# EAGLE design BOTTOM_BRD_v.0.1.0 (EAGLE 9.6.2)
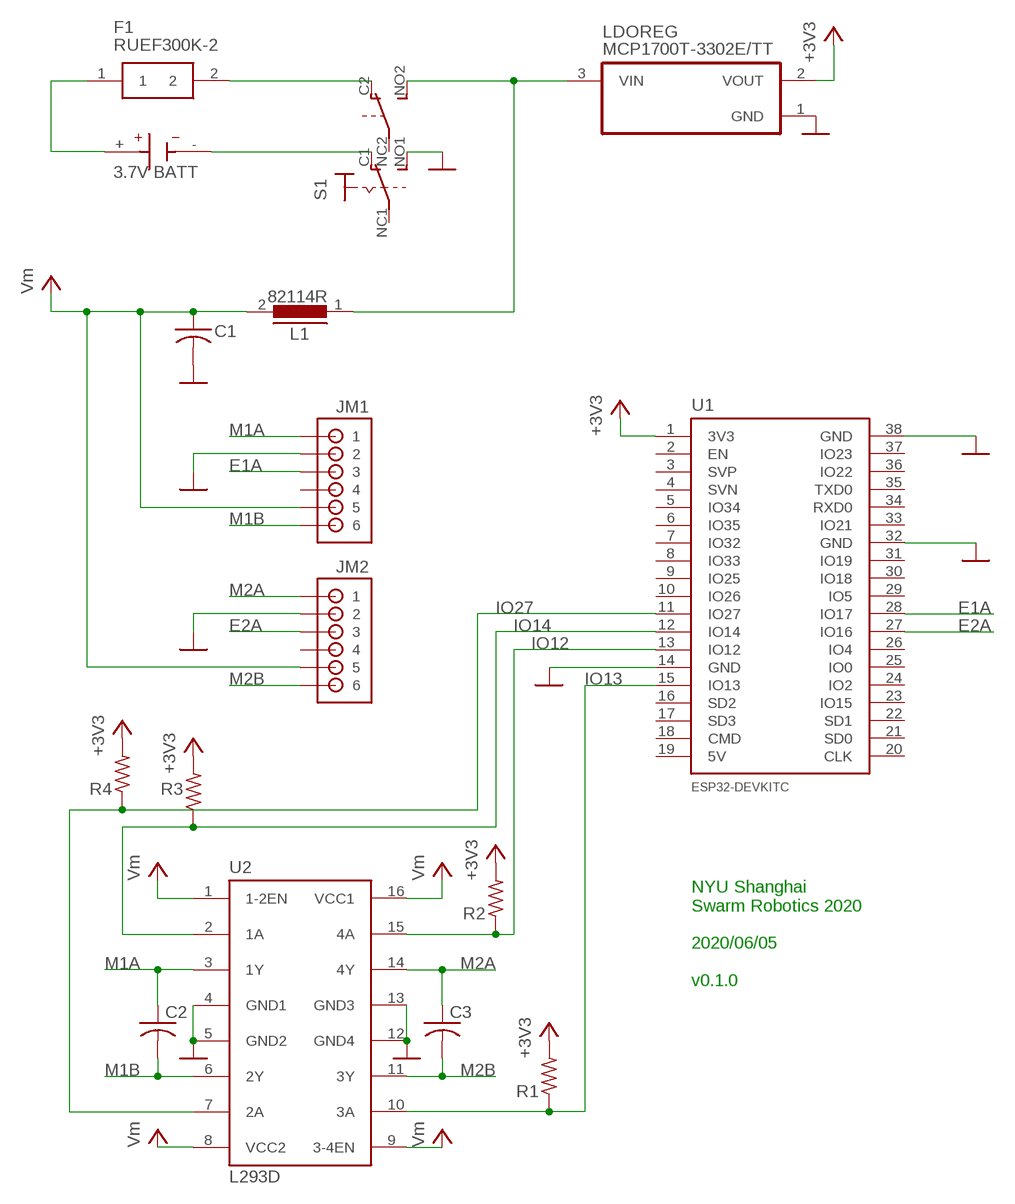
[diagram p0: schematic, sheet 1]

## Parts
BT1  3.7V BATT  6S-AA  [BAT_6S-AA]
C1  C-US025-030X050  [C025-030X050]
C2  C-US025-025X050  [C025-025X050]
C3  C-US025-025X050  [C025-025X050]
F1  RUEF300K-2  [RUEF300K2]
JM1  B6B-ZR  [B6B-ZR]
JM2  B6B-ZR  [B6B-ZR]
L1  82114R  [82114R]
LDOREG  MCP1700T-3302E/TT  [SOT95P237X112-3N]
R1  R-US_0207/9  [0207/9]
R2  R-US_0207/9  [0207/9]
R3  R-US_0207/9  [0207/9]
R4  R-US_0207/9  [0207/9]
S1  SWITCH_320-938  [PS22F03]
U1  ESP32DEVKITC  [ESP32-DEVKITC]
U2  L293D  [DIL16]

## Nets
+3V3: LDOREG.2(VOUT) R1.2 R2.2 R3.2 R4.2 U1.1(3V3)
E1A: JM1.3 U1.28(IO17)
E2A: JM2.3 U1.27(IO16)
GND: C1.2 JM1.2 JM2.2 LDOREG.1(GND) S1.NO1(1:S) U1.14(GND) U1.32(GND) U1.38(GND) U2.4(GND1) U2.5(GND2) U2.12(GND4) U2.13(GND3)
IO12: R2.1 U1.13(IO12) U2.15(4A)
IO13: R1.1 U1.15(IO13) U2.10(3A)
IO14: R3.1 U1.12(IO14) U2.2(1A)
IO27: R4.1 U1.11(IO27) U2.7(2A)
M1A: C2.1 JM1.1 U2.3(1Y)
M1B: C2.2 JM1.6 U2.6(2Y)
M2A: C3.1 JM2.1 U2.14(4Y)
M2B: C3.2 JM2.6 U2.11(3Y)
N$1: BT1.+ F1.1
N$3: F1.2 S1.C2(B:O)
N$5: BT1.- S1.C1(1:O)
N$6: L1.1 LDOREG.3(VIN) S1.NO2(B:S)
VCC: C1.1 JM1.5 JM2.5 L1.2 U2.1(1-2EN) U2.8(VCC2) U2.9(3-4EN) U2.16(VCC1) ; supply symbol labelled Vm
Unconnected: JM1.4 JM2.4 S1.NC1(1:P) S1.NC2(B:P) U1.2(EN) U1.3(SVP) U1.4(SVN) U1.5(IO34) U1.6(IO35) U1.7(IO32) U1.8(IO33) U1.9(IO25) U1.10(IO26) U1.16(SD2) U1.17(SD3) U1.18(CMD) U1.19(5V) U1.20(CLK) U1.21(SD0) U1.22(SD1) U1.23(IO15) U1.24(IO2) U1.25(IO0) U1.26(IO4) U1.29(IO5) U1.30(IO18) U1.31(IO19) U1.33(IO21) U1.34(RXD0) U1.35(TXD0) U1.36(IO22) U1.37(IO23)

## Notes on the sheet
- NYU Shanghai
  Swarm Robotics 2020
  
  2020/06/05
  
  v0.1.0

## Library data of the parts
BT1 = 6S-AA:6S-AA; AVAILABILITY: Unavailable; DESCRIPTION: BATTERY HOLDER AA PC PIN; DIGIKEY-PURCHASE-URL: https://snapeda.com/shop?store=DigiKey&id=4389101; MF: MPD; MP: 6S-AA; PACKAGE: None; PRICE: None
C1-C3 = adafruit:C-US: CAPACITOR, American symbol
F1 = RUEF300K-2:RUEF300K-2: TE CONNECTIVITY / RAYCHEM - RUEF300K-2 - RESETTABLE FUSE, PTC, 30V, 3A, RADIAL Source: Datasheet <http://www.farnell.com/datasheets/1482689.pdf>; DESCRIPTION: TE CONNECTIVITY / RAYCHEM - RUEF300K-2 - RESETTABLE FUSE, PTC, 30V, 3A, RADIAL; HEIGHT: 16.5mm; MANUFACTURER_NAME: TE CONNECTIVITY / RAYCHEM; MANUFACTURER_PART_NUMBER: RUEF300K-2
JM1 JM2 = B6B-ZR:B6B-ZR: JST-ZH Connector 6 pol, 1.5mm pitch Package: B6B-ZR Source: http://www.jst-mfg.com/product/pdf/eng/eZH.pdf; AVAILABILITY: Unavailable; DESCRIPTION: Connector Header Surface Mount 6 position 0.059 _1.50mm_; MF: JST; MP: B6B-ZR; PACKAGE: None; PRICE: None
L1 = inductors:82114R: INDUCTOR; SPICEPREFIX: L
LDOREG = MCP1700T-3302E_TT:MCP1700T-3302E/TT; AVAILABILITY: Unavailable; DESCRIPTION: IC REG LINEAR 3.3V 250MA SOT23-3; MF: Microchip Technology; MP: MCP1700T-3302E/TT; PACKAGE: None; PRICE: None
R1-R4 = adafruit:R-US_: RESISTOR, American symbol
S1 = ArduinoNano LearningBot 4-21-18:SWITCH_320-938: TOGGLE SWITCH distributor RS Components
U1 = ESP32-DEVKITC (1):ESP32DEVKITC
U2 = st-microelectronics:L293D: PUSH-PULL 4 CHANNEL DRIVER; MPN: L293D; OC_FARNELL: 9589619; OC_NEWARK: 56P8249

## Board
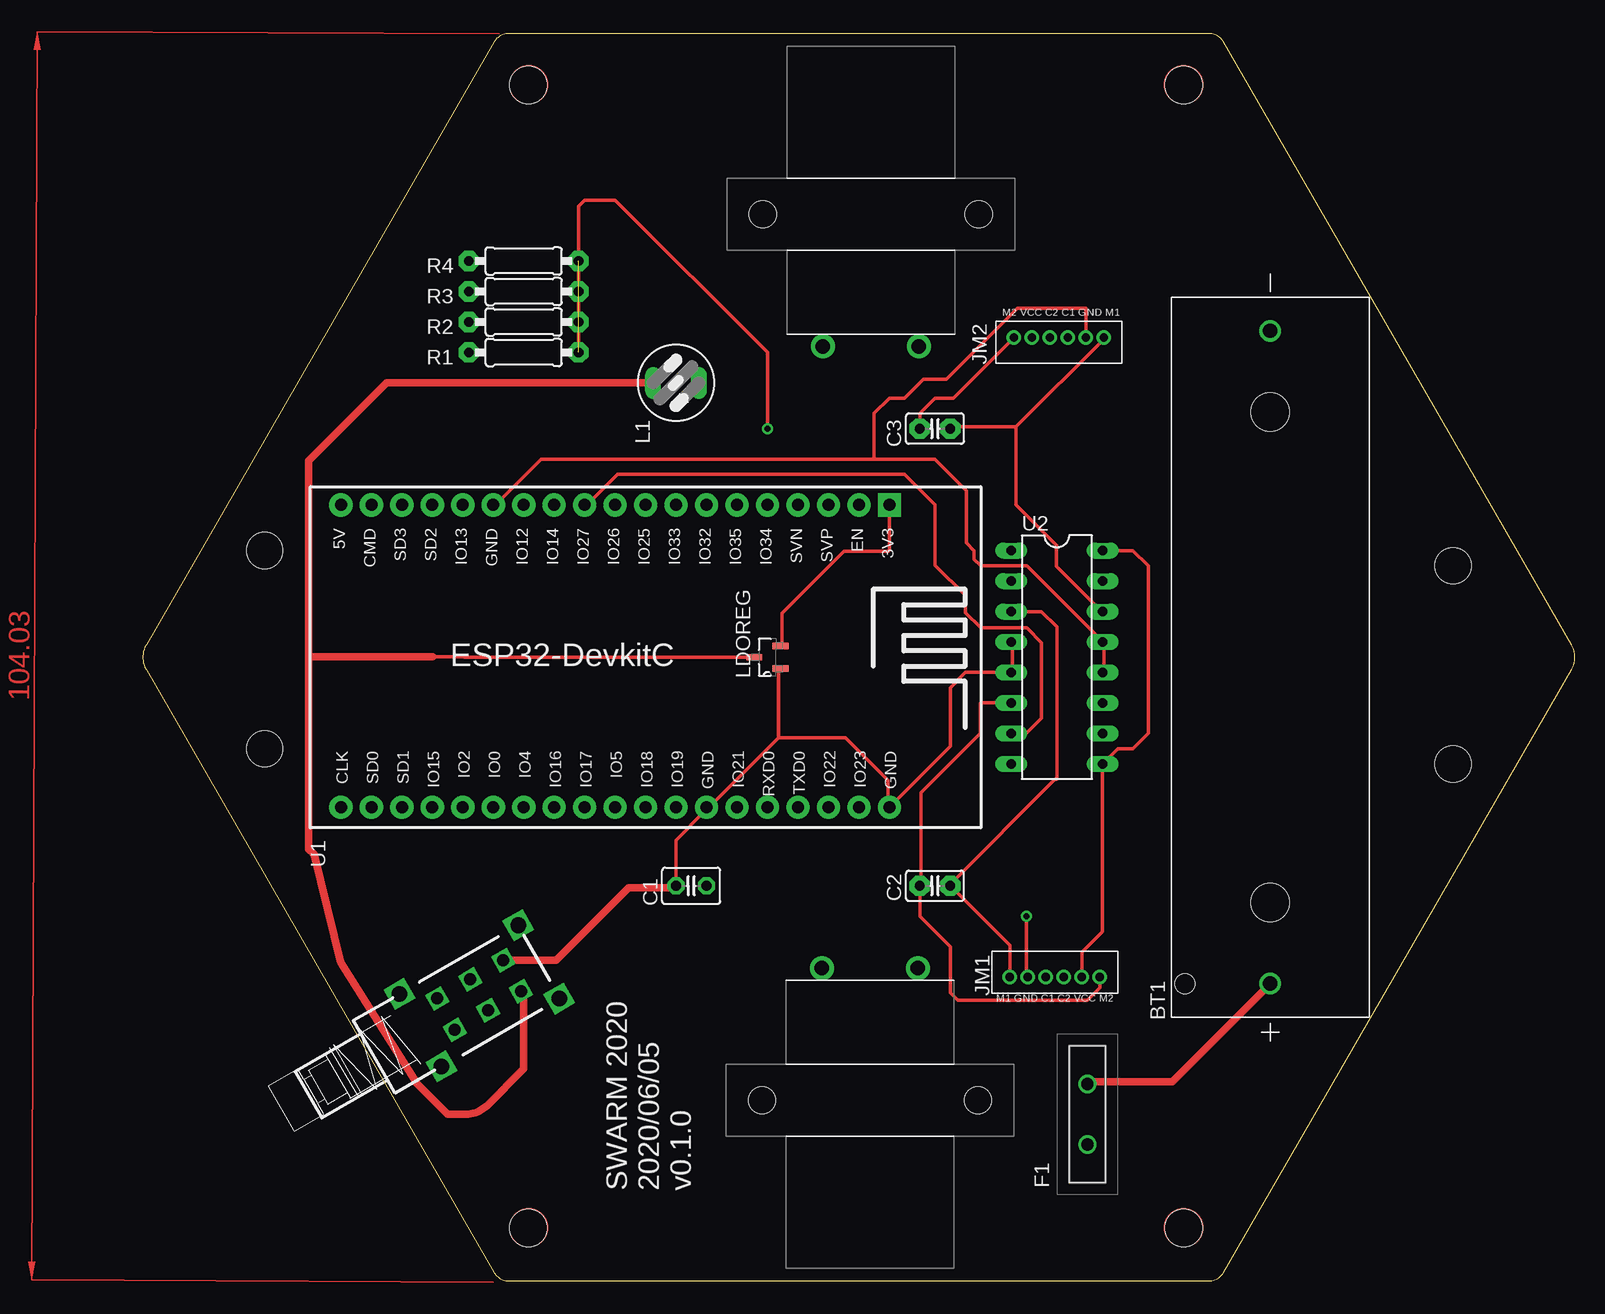
[diagram p1: board, top side]
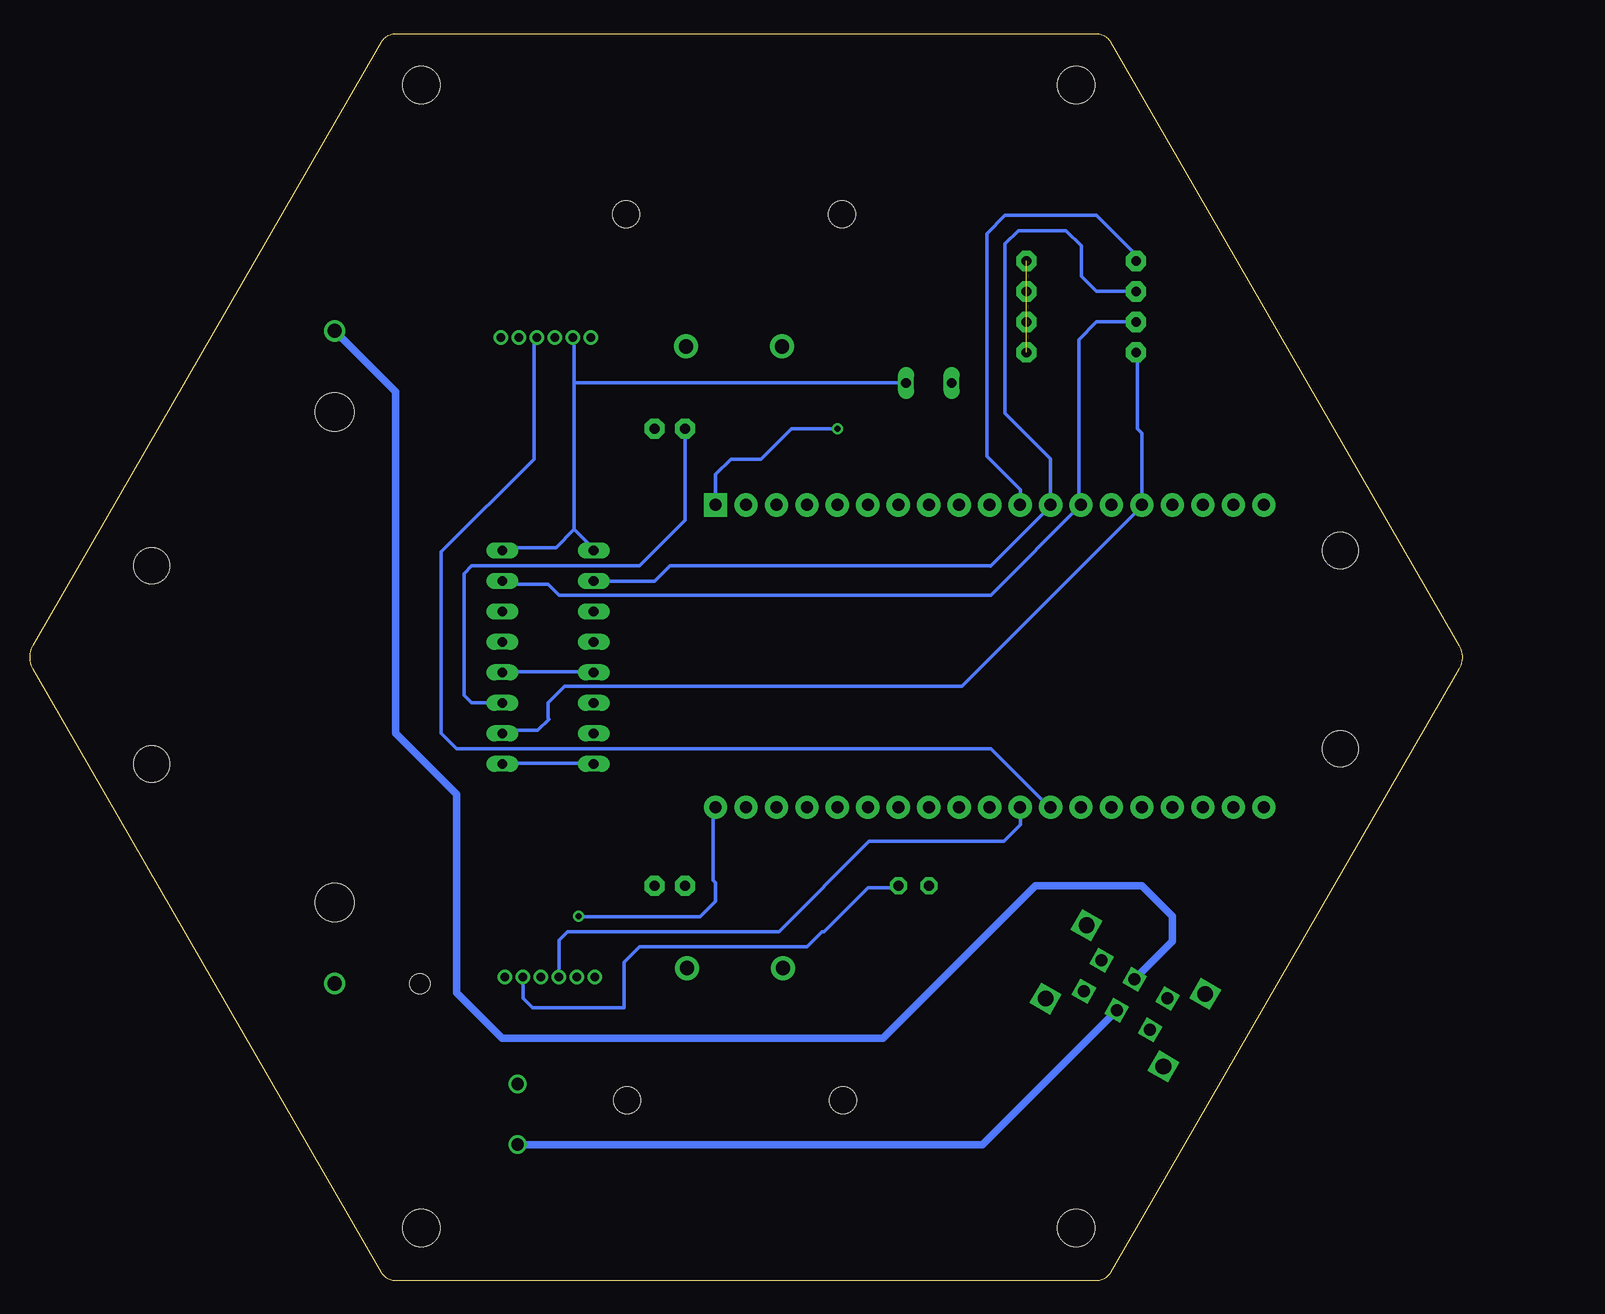
[diagram p2: board, bottom side, seen from below]

Size 119.38 x 103.92 mm. Coordinates in mm from the lower left corner, seen from the top.
Outline: 90.08,0.68 119.11,50.96 arc60 119.11,52.96 90.08,103.24 arc60 88.9,103.92 30.48,103.92 arc60 29.29,103.24 0.27,52.96 arc60 0.27,50.96 29.29,0.68 arc60 30.48,0 88.9,0 arc60 90.08,0.68
Copper layers (1*16): Top 0.035mm / dielectric 0.15mm / Bottom 0.035mm
Design rules "default *": minimum track width 12mil, minimum drill 0.5mm, track to track 12mil, track to pad 12mil, pad to pad 12mil, via to via 12mil, smd to smd 12mil, copper to edge 40mil, drill to drill 25mil, minimum pad ring 10mil, minimum via ring 8mil, stop-mask expansion 4mil, vias tented up to drill 0mil, thermal gap 10mil
Holes 3.1 mm at 32.15,4.41 86.76,4.41 86.76,99.66 32.15,99.66
Holes 3 mm at 10.16,60.85 10.16,44.34 109.22,59.58 109.22,43.07
tKeepout: area 29.3,1.5 to 35.1,7.3; area 83.9,1.5 to 89.7,7.3; area 83.9,96.8 to 89.7,102.6; area 29.3,96.8 to 35.1,102.6

### Footprints (pad centres in the part's own frame; a part is rotated, then mirrored left to right if it is on the bottom)
BAT_6S-AA = drill 1.19: + -27.2,0; - 27.2,0 | hole 3.2: -20.425,0; 20.425,0 | hole 1.67: -27.2,7.1
C025-030X050 = drill 0.813 pad 1.422 octagon: 1 -1.27,0; 2 1.27,0
C025-025X050 = drill 0.813 pad 1.676 octagon: 1 -1.27,0; 2 1.27,0
RUEF300K2 = drill 1.01 pad 1.515: 1 0,0; 2 5.05,0
B6B-ZR = drill 0.7: 1 9,-1.3; 2 7.5,-1.3; 3 6,-1.3; 4 4.5,-1.3; 5 3,-1.3; 6 1.5,-1.3
82114R = drill 0.813 long: 1 0,1.905; 2 0,-1.905
SOT95P237X112-3N = smd 1.321 x 0.559: 1 -1.092,0.94; 2 -1.092,-0.94 | smd 1.321 x 0.508: 3 1.092,0
0207/9 = drill 0.813 pad 1.676 octagon: 1 -4.572,0; 2 4.572,0
PS22F03 = drill 1.3 square: 0 -3.175,5.715; 1 3.835,5.613; 2 3.81,-5.715; 3 -3.175,-5.715 | drill 1 square: C1 -1.27,0; C2 1.702,0; NC1 -1.27,-3.175; NC2 1.727,-3.226; NO1 -1.27,3.175; NO2 1.702,3.15
ESP32-DEVKITC = drill 1 pad 1.93 square: 1 -0.01,0.01 | drill 1 pad 1.93: 2 2.53,0.01; 3 5.07,0.01; 4 7.61,0.01; 5 10.15,0.01; 6 12.69,0.01; 7 15.23,0.01; 8 17.77,0.01; 9 20.31,0.01; 10 22.85,0.01; 11 25.39,0.01; 12 27.93,0.01; 13 30.47,0.01; 14 33.01,0.01; 15 35.55,0.01; 16 38.09,0.01; 17 40.63,0.01; 18 43.17,0.01; 19 45.71,0.01; 20 45.71,25.2; 21 43.17,25.2; 22 40.63,25.2; 23 38.09,25.2; 24 35.55,25.2; 25 33.01,25.2; 26 30.47,25.2; 27 27.93,25.2; 28 25.39,25.2; 29 22.85,25.2; 30 20.31,25.2; 31 17.77,25.2; 32 15.23,25.2; 33 12.69,25.2; 34 10.15,25.2; 35 7.61,25.2; 36 5.07,25.2; 37 2.53,25.2; 38 -0.01,25.2
DIL16 = drill 0.813 long: 1 -8.89,-3.81; 2 -6.35,-3.81; 3 -3.81,-3.81; 4 -1.27,-3.81; 5 1.27,-3.81; 6 3.81,-3.81; 7 6.35,-3.81; 8 8.89,-3.81; 9 8.89,3.81; 10 6.35,3.81; 11 3.81,3.81; 12 1.27,3.81; 13 -1.27,3.81; 14 -3.81,3.81; 15 -6.35,3.81; 16 -8.89,3.81
VIBE-MOTOR-10MM = drill 1.2 pad 2: + 13,-11; - 5,-11 | hole 2.25: 0,0; 18,0

### Placement (x,y rotation side)
BT1  93.98,51.96 90 top
C1  45.72,32.91 180 top
C2  66.04,32.91 180 top
C3  66.04,71.01 180 top
F1  78.74,16.4 270 top
JM1  81.28,24.02 180 top
JM2  71.12,79.9 0 top
L1  44.45,74.82 90 top
LDOREG  52.07,51.96 180 top
R1  31.75,77.36 0 top
R2  31.75,79.9 0 top
R3  31.75,82.44 0 top
R4  31.75,84.98 0 top
S1  27.94,24.02 300 top
U1  62.23,64.66 180 top
U2  76.2,51.96 270 top
U$1  MOTOR10MM  [VIBE-MOTOR-10MM]  51.69,88.87 0 top
U$7  MOTOR10MM  [VIBE-MOTOR-10MM]  69.61,15.05 180 top

### Tracks (layer width: path | path; a pad name or v marks a point on that pad's centre or on a via)
+3V3  (via drill 0.5)  (3 unrouted)
  Top 0.305: LDOREG.2 53.29,52.88 53.29,55.62 58.47,60.8 62.18,60.8 62.24,60.86 U1.1 | v52.07,71.01 52.07,77.36 39.37,90.06 36.83,90.06 36.32,89.55 R1.2
  Bottom 0.305: v52.07,71.01 55.88,71.01 58.42,68.47 60.96,68.47 62.23,67.2 U1.1
E1A
  Bottom 0.305: U1.28 36.93,39.37 36.83,39.26 36.83,37.99 38.2,36.62 49.43,36.62 56.94,29.1 74.55,29.1 75.28,28.37 JM1.3
E2A
  Bottom 0.305: JM2.3 77.37,78.48 77.37,68.47 85.09,60.75 85.09,45.61 83.82,44.34 82.55,44.34 39.27,44.34 34.39,39.47 U1.27
GND  (via drill 0.5)
  Top 0.305: 52.98,45.26 52.98,51.05 LDOREG.1 | 52.98,45.26 47.19,39.47 U1.32 46.89,39.16 44.45,36.72 C1.2 44.45,32.76 | 52.98,45.26 58.57,45.26 62.13,41.7 62.13,39.47 U1.38 67.31,44.53 67.31,49.42 68.58,50.69 U2.5 | U2.5 72.49,50.74 72.49,53.18 U2.4 | U2.12 80.11,50.74 80.11,53.18 U2.13 79.8,53.49 73.71,59.58 69.85,59.58 69.29,60.14 69.29,60.85 68.65,61.49 68.65,65.86 66.04,68.47 60.96,68.47 | U1.14 29.51,64.76 33.22,68.47 60.96,68.47 | 72.18,50.74 U2.5 | JM2.2 78.62,81.05 72.93,81.05 67,75.13 65.07,75.13 63.5,73.55 62.23,73.55 60.96,72.28 60.96,68.47 | JM1.2 73.66,25.44 v73.66,30.37
  Top 0.635: S1.NO1 34.43,26.71 40.49,32.76 44.45,32.76
  Bottom 0.305: U1.38 62.43,39.16 62.43,33.37 62.23,33.17 62.23,31.64 63.52,30.35 73.63,30.35 v73.66,30.37 | U2.5 72.49,50.74 79.8,50.74 U2.12
IO12
  Bottom 0.305: U2.15 79.8,58.06 76.2,58.06 75.28,57.14 39.27,57.14 U1.13 31.95,64.76 31.95,78.43 30.48,79.9 R2.1
IO13
  Bottom 0.305: U2.10 79.8,45.87 77.06,45.87 76.12,46.81 76.2,46.88 76.2,48.15 74.83,49.52 41.7,49.52 26.77,64.46 U1.15 26.68,70.62 27.07,71.01 27.07,77.26 R1.1
IO14
  Bottom 0.305: U2.2 67.31,58.31 66.04,59.58 39.37,59.58 39.32,59.53 34.39,64.46 U1.12 34.3,68.48 38.1,72.28 38.1,86.4 36.98,87.52 33.02,87.52 31.75,86.25 31.75,84.98 31.75,83.71 30.48,82.44 R3.1
IO27
  Top 0.305: U1.11 37.13,64.76 39.57,67.2 63.5,67.2 66.04,64.66 66.04,59.63 68.6,57.07 68.58,57.04 68.58,55.67 69.85,54.4 73.71,54.4 74.93,53.18 74.93,46.88 73.66,45.61 U2.7
  Bottom 0.305: R4.1 27.18,85.49 30.48,88.79 38.1,88.79 39.62,87.27 39.62,71.01 39.62,68.73 36.83,65.93 U1.11
M1A
  Top 0.305: 73.4,55.62 72.49,55.62 U2.3 74.93,55.77 76.2,54.5 76.2,41.8 76.05,41.8 67.31,33.06 C2.1 72.28,27.94 JM1.1
  Bottom 0.305: 67.31,32.76 C2.1
M1B
  Top 0.305: 64.87,32.76 C2.2 | C2.2 64.87,33.06 64.87,40.68 69.82,45.64 69.82,48.13 69.85,48.15 U2.6 | JM1.6 79.78,24.4 78.74,23.36 67.97,23.36 67.31,24.02 67.31,27.83 64.77,30.37 C2.2
M2A
  Top 0.305: 72.79,71.16 80.11,78.48 JM2.1 | 72.79,71.16 67.31,71.16 C3.1 | 72.79,71.16 72.79,64.66 76.17,61.28 76.17,59.56 79.8,55.92 U2.14
M2B
  Top 0.305: JM2.6 72.49,78.48 67.56,73.55 66.04,73.55 65.28,72.79 64.77,72.28 C3.2
  Bottom 0.305: U2.11 82.55,48.15 83.21,48.81 83.21,58.92 82.55,59.58 68.58,59.58 64.77,63.39 C3.2
N$1
  Top 0.635: BT1.+ 85.82,16.61 78.94,16.61 F1.1
N$3
  Bottom 0.635: F1.2 39.98,11.35 S1.C2
N$5
  Bottom 0.635: S1.C1 24.13,28.3 24.13,30.37 26.67,32.91 35.56,32.91 48.26,20.21 80.01,20.21 83.82,24.02 83.82,40.53 88.9,45.61 88.9,74.08 BT1.-
N$6
  Top 0.305: LDOREG.3 26.77,51.96 26.72,52.01 24.18,52.01 | 31.34,24.23 S1.NO2 | 21.59,74.82 L1.1
  Top 0.635: S1.NO2 31.75,23.89 31.75,17.67 28.68,14.61 arc-45 26.89,13.86 25.4,13.86 22.86,16.4 16.51,26.56 14.27,35.53 13.82,35.98 13.82,51.96 | L1.1 20.32,74.82 13.82,68.32 13.82,51.96 | 13.82,51.96 13.87,52.01 24.18,52.01
VCC
  Top 0.305: 79.8,42.82 U2.9 | U2.16 80.11,60.8 80.16,60.85 82.55,60.85 83.82,59.58 83.82,45.61 82.55,44.34 81.28,44.34 U2.9 | U2.9 80.01,29.1 78.28,27.37 JM1.5
  Bottom 0.305: U2.8 72.49,43.12 79.8,43.12 U2.9 | C1.1 47.19,32.76 49.53,32.76 53.19,29.1 53.34,29.1 54.61,27.83 68.58,27.83 69.85,26.56 69.85,22.75 77.47,22.75 78.28,23.56 JM1.5 | 74.01,62.63 74.01,74.82 | 74.01,74.82 74.01,78.48 JM2.5 | 74.01,62.63 72.49,61.11 U2.1 | 74.01,74.82 L1.2 | 74.01,62.63 75.54,61.11 79.8,61.11 U2.16
(copper drawn outside any net)
  shapes: Top area x1, Top circle x4

### Text on the board
tPlace: M2 VCC C2 C1 GND M1 | M1 GND C1 C2 VCC M2 | SWARM 2020 / 2020/06/05 / v0.1.0